# Altium schematic sheet rad_detector_v500_MCU.SchDoc
size A4; SheetNumber: 4; SheetTotal: 7
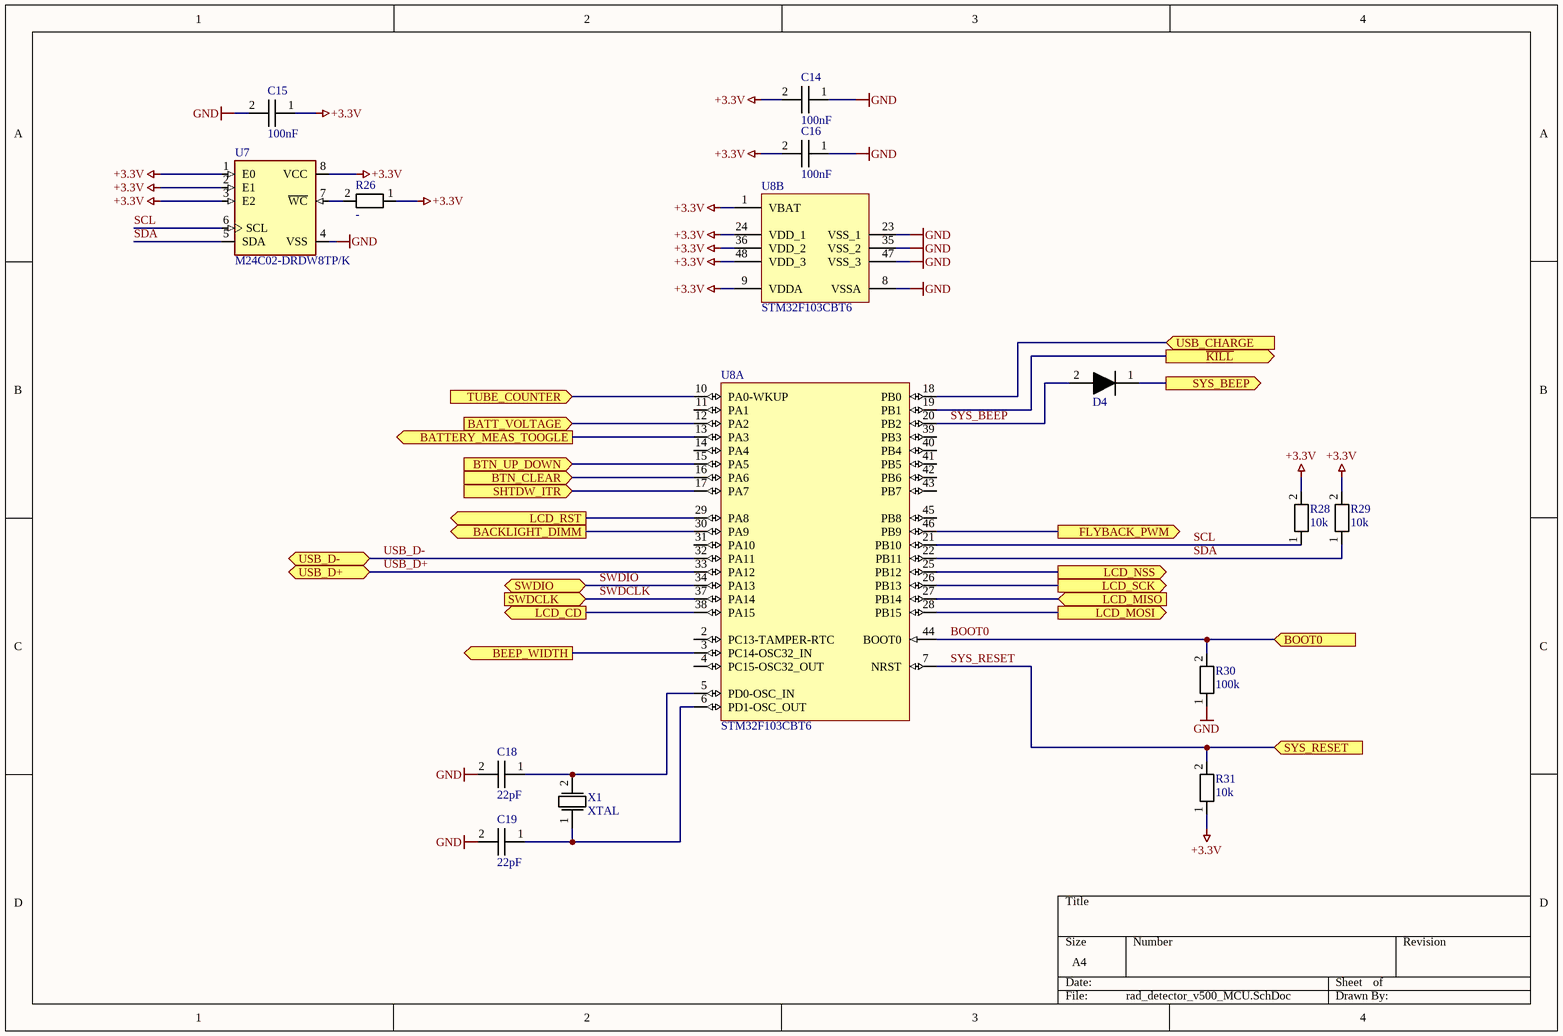
[diagram p0: rad_detector_v500_MCU.SchDoc]

## Parts
C14  100nF  [0805_C]
C15  100nF  [0805_C]
C16  100nF  [0805_C]
C18  22pF  [0805_C]
C19  22pF  [0805_C]
D4  DIODE  [SMD_DIODE_SOD80]  (value not drawn)
R26  -  [0805]
R28  10k  [0805]
R29  10k  [0805]
R30  100k  [0805]
R31  10k  [0805]
U7  M24C02-DRDW8TP/K  [TSSOP8]
U8  STM32F103CBT6  [STM-LQFP48_N]  (parts A,B of 2)
X1  XTAL  [XTAL_SMD]

## Ports
BACKLIGHT_DIMM (out, see rad_detector_v500_MAIN[2C]), BATT_VOLTAGE (in, see rad_detector_v500_MAIN[3C], rad_detector_v500_PSU[3B]), BATTERY_MEAS_TOOGLE (out, see rad_detector_v500_MAIN[3C]), BEEP_WIDTH (out, see rad_detector_v500_MAIN[2B]), BOOT0 (in, see rad_detector_v500_MAIN[2B]), BTN_CLEAR (in, see rad_detector_v500_MAIN[2C], rad_detector_v500_PERIPHERAL[4B]), BTN_UP_DOWN (in, see rad_detector_v500_MAIN[2C], rad_detector_v500_PERIPHERAL[4C]), FLYBACK_PWM (out, see rad_detector_v500_MAIN[3B]), LCD_CD (out, see rad_detector_v500_MAIN[2C], rad_detector_v500_PERIPHERAL[1B]), LCD_MISO (in, see rad_detector_v500_MAIN[2C]), LCD_MOSI (out, see rad_detector_v500_MAIN[2C], rad_detector_v500_PERIPHERAL[1B]), LCD_NSS (out, see rad_detector_v500_MAIN[2C]), LCD_RST (out, see rad_detector_v500_MAIN[2C], rad_detector_v500_PERIPHERAL[1B]), LCD_SCK (out, see rad_detector_v500_MAIN[2C], rad_detector_v500_PERIPHERAL[1B]), SHTDW_ITR (in, see rad_detector_v500_MAIN[3B], rad_detector_v500_PSU[3C]), SWDCLK (in, see rad_detector_v500_MAIN[2B], rad_detector_v500_CONN[3C]), SWDIO (bidir, see rad_detector_v500_MAIN[2B], rad_detector_v500_CONN[3C]), SYS_BEEP (out, see rad_detector_v500_MAIN[2C]), SYS_RESET (in, see rad_detector_v500_MAIN[2B]), TUBE_COUNTER (in, see rad_detector_v500_MAIN[2B], rad_detector_v500_ANA[3C]), USB_CHARGE (in, see rad_detector_v500_MAIN[3B], rad_detector_v500_PSU[1B]), USB_D+ (bidir, see rad_detector_v500_MAIN[2B]), USB_D- (bidir, see rad_detector_v500_MAIN[2B]), ~{KILL} (out, see rad_detector_v500_MAIN[3B], rad_detector_v500_PSU[3C])

## Nets
+3.3V: C14.2 C15.1 C16.2 R26.1 R28.2 R29.2 R31.1 U7.1(E0) U7.2(E1) U7.3(E2) U7.8(VCC) U8.1(VBAT) U8.9(VDDA) U8.24(VDD_1) U8.36(VDD_2) U8.48(VDD_3)
GND: C14.1 C15.2 C16.1 C18.2 C19.2 R30.1 U7.4(VSS) U8.8(VSSA) U8.23(VSS_1) U8.35(VSS_2) U8.47(VSS_3)
BACKLIGHT_DIMM: U8.30(PA9) ; port BACKLIGHT_DIMM
BATT_VOLTAGE: U8.12(PA2) ; port BATT_VOLTAGE
BATTERY_MEAS_TOOGLE: U8.13(PA3) ; port BATTERY_MEAS_TOOGLE
BEEP_WIDTH: U8.3(PC14-OSC32_IN) ; port BEEP_WIDTH
BOOT0: R30.2 U8.44(BOOT0) ; port BOOT0
BTN_CLEAR: U8.16(PA6) ; port BTN_CLEAR
BTN_UP_DOWN: U8.15(PA5) ; port BTN_UP_DOWN
FLYBACK_PWM: U8.46(PB9) ; port FLYBACK_PWM
~{KILL}: U8.19(PB1) ; port ~{KILL}
LCD_CD: U8.38(PA15) ; port LCD_CD
LCD_MISO: U8.27(PB14) ; port LCD_MISO
LCD_MOSI: U8.28(PB15) ; port LCD_MOSI
LCD_NSS: U8.25(PB12) ; port LCD_NSS
LCD_RST: U8.29(PA8) ; port LCD_RST
LCD_SCK: U8.26(PB13) ; port LCD_SCK
SCL: R28.1 U7.6(SCL) U8.21(PB10)
SDA: R29.1 U7.5(SDA) U8.22(PB11)
SHTDW_ITR: U8.17(PA7) ; port SHTDW_ITR
SWDCLK: U8.37(PA14) ; port SWDCLK
SWDIO: U8.34(PA13) ; port SWDIO
SYS_BEEP: D4.2 U8.20(PB2)
SYS_BEEP: D4.1 ; port SYS_BEEP  [a separate net that carries the same name]
SYS_RESET: R31.2 U8.7(NRST) ; port SYS_RESET
TUBE_COUNTER: U8.10(PA0-WKUP) ; port TUBE_COUNTER
USB_CHARGE: U8.18(PB0) ; port USB_CHARGE
USB_D+: U8.33(PA12) ; port USB_D+
USB_D-: U8.32(PA11) ; port USB_D-
NetC18_1: C18.1 U8.5(PD0-OSC_IN) X1.2
NetC19_1: C19.1 U8.6(PD1-OSC_OUT) X1.1
NetR26_2: R26.2 U7.7(~{WC})

Not connected (* = marked no-connect by the designer): U8 2(PC13-TAMPER-RTC) 4(PC15-OSC32_OUT) 11(PA1) 14(PA4) 31(PA10) 39(PB3) 40(PB4) 41(PB5) 42(PB6) 43(PB7) 45(PB8)

## Library data of the parts
C14-C16 C18 C19 = CAPACITOR
R26 R30 = RESISTOR: Parameter 1: 10k
R28 R29 R31 = RESISTOR: Parameter 1: 10k
U7 = M24C02-FDW6TP: EEPROM Memory IC 2Kb (256 x 8) I2C 400kHz 900ns 8-TSSOP; MF: STMicroelectronics; Package: TSSOP-8 STMicroelectronics; MP: M24C02-FDW6TP; Digi-Key_Part_Number: 497-15746-1-ND; Value: *; SnapEDA_Link: https://www.snapeda.com/parts/M24C02-FDW6TP/STMicroelectronics/view-part/1102461/?ref=snap
U8 = STM32F103CBT6: ARM Cortex-M3 32-bit MCU, 128 KB Flash, 20 KB Internal RAM, 37 I/Os, 48-pin LQFP, -40 to 85 degC, Tray; Supply Voltage(Vcc) min (V): 2; Operating Frequency(F) (Processor speed) (MHz): 72; A/D Converter: 2x12-bit (10 Channel); FLASH Size (Prog) (kB): 128; Internal RAM Size (kB): 20; I/Os (High Current): 37; ComponentLink2Description: Datasheet; PackageReference: LQFP48; PartNumber: STM32F103CBT6; ComponentLink1Description: Manufacturer URL; DatasheetVersion: Rev. 16; PackageVersion: Rev. 6, 06/2013; Packing: Tray; ComponentLink1URL: http://www.st.com/web/en/home.html; Mounting Technology: Surface Mount; ComponentLink3URL: http://www.st.com/st-web-ui/static/active/en/resource/technical/document/datasheet/DM00058181.pdf; PackageDescription: 48-Pin Low Profile Quad Flat Package, 7 x 7 mm Body, 0.5 mm Pitch; Core: ARM Cortex-M3; ComponentLink3Description: Package Specification; ComponentLink2URL: http://www.st.com/st-web-ui/static/active/en/resource/technical/document/datasheet/CD00161566.pdf